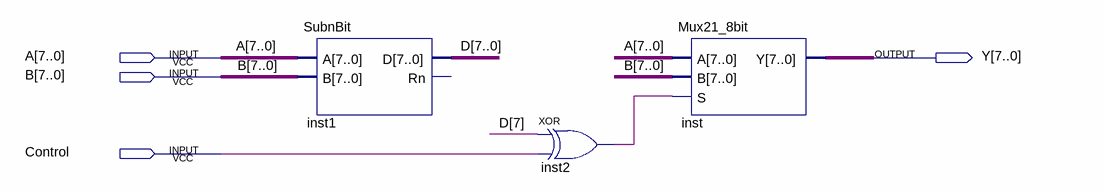
[diagram p0: schematic sheet]
// Quartus schematic MinMax.bdf as structural Verilog: 3 symbols, 4 pins
module MinMax (
  input  [7:0] A,
  input  [7:0] B,
  input  Control,
  output [7:0] Y
);

  wire inst2_out;
  wire [7:0] D;

  SubnBit inst1 (.A(A), .B(B), .D(D));  // open: Rn
  xor inst2 (inst2_out, D[7], Control);
  Mux21_8bit inst (.A(A), .B(B), .S(inst2_out), .Y(Y));
endmodule
